# Altium schematic sheet PREAMP1.SchDoc: PREAMP 1
size A3; Date: 2011-11-28; Author: S.Choquette; Revision: 2.0; SheetNumber: 9; SheetTotal: 9
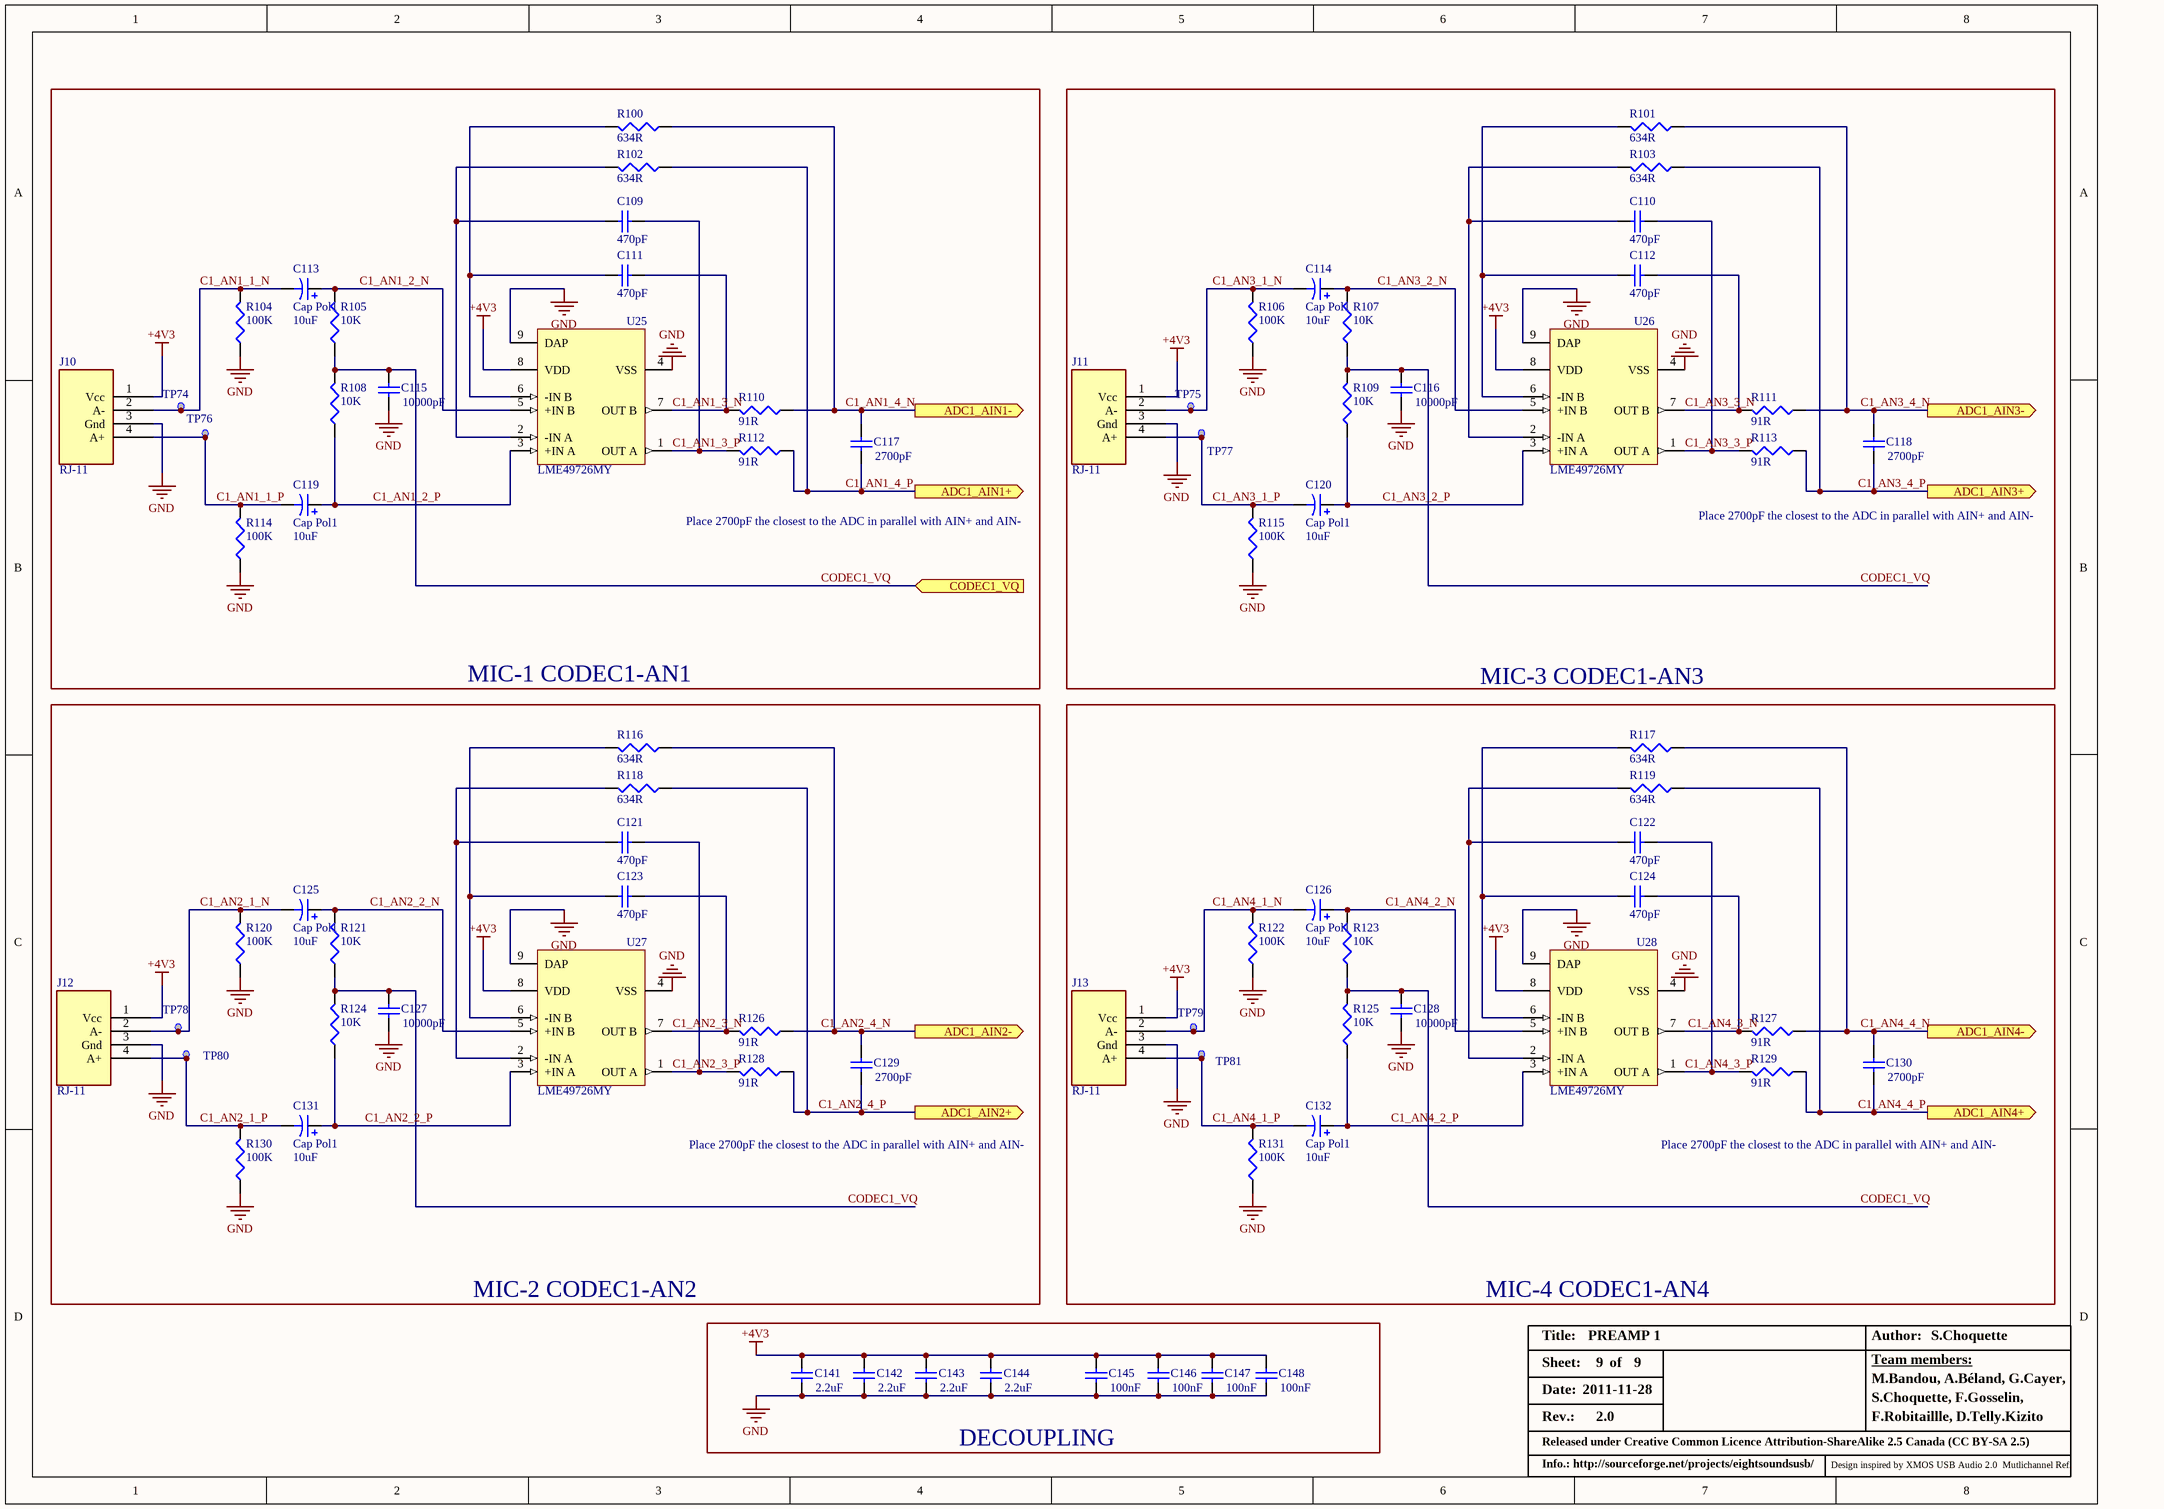
[diagram p0: PREAMP1.SchDoc]

## Parts
C109  value 470pF  [3-0603]
C110  value 470pF  [3-0603]
C111  value 470pF  [3-0603]
C112  value 470pF  [3-0603]
C113  Cap Pol1  value 10uF  [AL_ELEC_SMD_B]
C114  Cap Pol1  value 10uF  [AL_ELEC_SMD_B]
C115  value 10000pF  [2-0402]
C116  value 10000pF  [2-0402]
C117  value 2700pF  [2-0402]
C118  value 2700pF  [2-0402]
C119  Cap Pol1  value 10uF  [AL_ELEC_SMD_B]
C120  Cap Pol1  value 10uF  [AL_ELEC_SMD_B]
C121  value 470pF  [3-0603]
C122  value 470pF  [3-0603]
C123  value 470pF  [3-0603]
C124  value 470pF  [3-0603]
C125  Cap Pol1  value 10uF  [AL_ELEC_SMD_B]
C126  Cap Pol1  value 10uF  [AL_ELEC_SMD_B]
C127  value 10000pF  [2-0402]
C128  value 10000pF  [2-0402]
C129  value 2700pF  [2-0402]
C130  value 2700pF  [2-0402]
C131  Cap Pol1  value 10uF  [AL_ELEC_SMD_B]
C132  Cap Pol1  value 10uF  [AL_ELEC_SMD_B]
C141  value 2.2uF  [8-1206]
C142  value 2.2uF  [8-1206]
C143  value 2.2uF  [8-1206]
C144  value 2.2uF  [8-1206]
C145  value 100nF  [2-0402]
C146  value 100nF  [2-0402]
C147  value 100nF  [2-0402]
C148  value 100nF  [2-0402]
J10  RJ-11  [RJ11]
J11  RJ-11  [RJ11]
J12  RJ-11  [RJ11]
J13  RJ-11  [RJ11]
R100  value 634R  [3-0603]
R101  value 634R  [3-0603]
R102  value 634R  [3-0603]
R103  value 634R  [3-0603]
R104  value 100K  [3-0603]
R105  value 10K  [3-0603]
R106  value 100K  [3-0603]
R107  value 10K  [3-0603]
R108  value 10K  [3-0603]
R109  value 10K  [3-0603]
R110  value 91R  [3-0603]
R111  value 91R  [3-0603]
R112  value 91R  [3-0603]
R113  value 91R  [3-0603]
R114  value 100K  [3-0603]
R115  value 100K  [3-0603]
R116  value 634R  [3-0603]
R117  value 634R  [3-0603]
R118  value 634R  [3-0603]
R119  value 634R  [3-0603]
R120  value 100K  [3-0603]
R121  value 10K  [3-0603]
R122  value 100K  [3-0603]
R123  value 10K  [3-0603]
R124  value 10K  [3-0603]
R125  value 10K  [3-0603]
R126  value 91R  [3-0603]
R127  value 91R  [3-0603]
R128  value 91R  [3-0603]
R129  value 91R  [3-0603]
R130  value 100K  [3-0603]
R131  value 100K  [3-0603]
TP74  TP  [TP]  (value not drawn)
TP75  TP  [TP]  (value not drawn)
TP76  TP  [TP]  (value not drawn)
TP77  TP  [TP]  (value not drawn)
TP78  TP  [TP]  (value not drawn)
TP79  TP  [TP]  (value not drawn)
TP80  TP  [TP]  (value not drawn)
TP81  TP  [TP]  (value not drawn)
U25  LME49726MY  [LME49726]
U26  LME49726MY  [LME49726]
U27  LME49726MY  [LME49726]
U28  LME49726MY  [LME49726]

## Blocks framed on the sheet
MIC-1 CODEC1-AN1: C109 C111 C113 C115 C117 C119 J10 R100 R102 R104 R105 R108 R110 R112 R114 TP74 TP76 U25
MIC-3 CODEC1-AN3: C110 C112 C114 C116 C118 C120 J11 R101 R103 R106 R107 R109 R111 R113 R115 TP75 TP77 U26
MIC-2 CODEC1-AN2: C121 C123 C125 C127 C129 C131 J12 R116 R118 R120 R121 R124 R126 R128 R130 TP78 TP80 U27
MIC-4 CODEC1-AN4: C122 C124 C126 C128 C130 C132 J13 R117 R119 R122 R123 R125 R127 R129 R131 TP79 TP81 U28
DECOUPLING: C141-C148

## Ports
ADC1_AIN1+ (out), ADC1_AIN1- (out), ADC1_AIN2+ (out), ADC1_AIN2- (out), ADC1_AIN3+ (out), ADC1_AIN3- (out), ADC1_AIN4+ (out), ADC1_AIN4- (out), CODEC1_VQ (in)

## Nets
+4V3: C141.2 C142.2 C143.2 C144.2 C145.2 C146.2 C147.2 C148.2 J10.1(Vcc) J11.1(Vcc) J12.1(Vcc) J13.1(Vcc) U25.8(VDD) U26.8(VDD) U27.8(VDD) U28.8(VDD)
GND: C115.1 C116.1 C127.1 C128.1 C141.1 C142.1 C143.1 C144.1 C145.1 C146.1 C147.1 C148.1 J10.3(Gnd) J11.3(Gnd) J12.3(Gnd) J13.3(Gnd) R104.1 R106.1 R114.1 R115.1 R120.1 R122.1 R130.1 R131.1 U25.4(VSS) U25.9(DAP) U26.4(VSS) U26.9(DAP) U27.4(VSS) U27.9(DAP) U28.4(VSS) U28.9(DAP)
C1_AN1_1_N: C113.2 J10.2(A-) R104.2 TP74.1
C1_AN1_1_P: C119.2 J10.4(A+) R114.2 TP76.1
C1_AN1_2_N: C113.1 R105.2 U25.5(+IN_B)
C1_AN1_2_P: C119.1 R108.1 U25.3(+IN_A)
C1_AN1_3_N: C111.1 R110.2 U25.7(OUT_B)
C1_AN1_3_P: C109.1 R112.2 U25.1(OUT_A)
C1_AN1_4_N: C117.2 R100.1 R110.1 ; port ADC1_AIN1-
C1_AN1_4_P: C117.1 R102.1 R112.1 ; port ADC1_AIN1+
C1_AN2_1_N: C125.2 J12.2(A-) R120.2 TP78.1
C1_AN2_1_P: C131.2 J12.4(A+) R130.2 TP80.1
C1_AN2_2_N: C125.1 R121.2 U27.5(+IN_B)
C1_AN2_2_P: C131.1 R124.1 U27.3(+IN_A)
C1_AN2_3_N: C123.1 R126.2 U27.7(OUT_B)
C1_AN2_3_P: C121.1 R128.2 U27.1(OUT_A)
C1_AN2_4_N: C129.2 R116.1 R126.1 ; port ADC1_AIN2-
C1_AN2_4_P: C129.1 R118.1 R128.1 ; port ADC1_AIN2+
C1_AN3_1_N: C114.2 J11.2(A-) R106.2 TP75.1
C1_AN3_1_P: C120.2 J11.4(A+) R115.2 TP77.1
C1_AN3_2_N: C114.1 R107.2 U26.5(+IN_B)
C1_AN3_2_P: C120.1 R109.1 U26.3(+IN_A)
C1_AN3_3_N: C112.1 R111.2 U26.7(OUT_B)
C1_AN3_3_P: C110.1 R113.2 U26.1(OUT_A)
C1_AN3_4_N: C118.2 R101.1 R111.1 ; port ADC1_AIN3-
C1_AN3_4_P: C118.1 R103.1 R113.1 ; port ADC1_AIN3+
C1_AN4_1_N: C126.2 J13.2(A-) R122.2 TP79.1
C1_AN4_1_P: C132.2 J13.4(A+) R131.2 TP81.1
C1_AN4_2_N: C126.1 R123.2 U28.5(+IN_B)
C1_AN4_2_P: C132.1 R125.1 U28.3(+IN_A)
C1_AN4_3_N: C124.1 R127.2 U28.7(OUT_B)
C1_AN4_3_P: C122.1 R129.2 U28.1(OUT_A)
C1_AN4_4_N: C130.2 R117.1 R127.1 ; port ADC1_AIN4-
C1_AN4_4_P: C130.1 R119.1 R129.1 ; port ADC1_AIN4+
CODEC1_VQ: C115.2 C116.2 C127.2 C128.2 R105.1 R107.1 R108.2 R109.2 R121.1 R123.1 R124.2 R125.2 ; port CODEC1_VQ
NetC109_2: C109.2 R102.2 U25.2(-IN_A)
NetC110_2: C110.2 R103.2 U26.2(-IN_A)
NetC111_2: C111.2 R100.2 U25.6(-IN_B)
NetC112_2: C112.2 R101.2 U26.6(-IN_B)
NetC121_2: C121.2 R118.2 U27.2(-IN_A)
NetC122_2: C122.2 R119.2 U28.2(-IN_A)
NetC123_2: C123.2 R116.2 U27.6(-IN_B)
NetC124_2: C124.2 R117.2 U28.6(-IN_B)

## Notes on the sheet
- Place 2700pF the closest to the ADC in parallel with AIN+ and AIN-
- Title:
- Date:
- Sheet:
- of
- Author:
- Team members:
- M.Bandou, A.Béland, G.Cayer,
- Rev.:
- Released under Creative Common Licence Attribution-ShareAlike 2.5 Canada (CC BY-SA 2.5)
- S.Choquette, F.Gosselin,
- F.Robitaillle, D.Telly.Kizito
- Info.: http://sourceforge.net/projects/eightsoundsusb/
- Design inspired by XMOS USB Audio 2.0  Mutlichannel Ref.

## Library data of the parts
C109-C112 C121-C124 = Cap: MLCC 470pF 0603 COG 50V; Manufacturer: Murata; Part Number: GRM1885C1H471JA01D; Cost: 0,005
C113 C114 C119 C120 C125 C126 C131 C132 = Cap Pol1: Al Elec 10uF CaseB 16V; Manufacturer: Panasonic; Part Number: EEEFK1C100R; Cost: *
C115 C116 C127 C128 = Cap: MLCC 10000pF 0402 X7R 25V; Manufacturer: Murata; Part Number: GRM155R71E103KA01D; Cost: 0,005
C117 C118 C129 C130 = Cap: Temperature Compensating 2700pF 0402 COG 10V; Manufacturer: Murata; Part Number: GRM1557U1A272JA01D; Cost: 0,005
C141-C144 = Cap: MLCC 2.2uF 1206 X7R 50V; Manufacturer: Murata; Part Number: GRM31CR71H225KA88L
C145-C148 = Cap: MLCC 100nF 0402 X7R 16V; Manufacturer: Murata; Part Number: GRM155R71C104KA88; Cost: 0,005
J10 J12 = RJ-11: CONN 6-4 MOD JACK; Part Number: SS-6446-NF; Manufacturer: Stewart Connector
J11 J13 = RJ-11: CONN 6-4 MOD JACK; Manufacturer: Stewart Connector; Part Number: SS-6446-NF
R100-R103 R116-R119 = Res3: RES 634R 0603 1%; Manufacturer: ROHM; Part Number: MCR03EZPFX6340; Cost: *
R104 R106 R114 R115 R120 R122 R130 R131 = Res3: RES 100k 0603 1%; Manufacturer: ROHM; Part Number: MCR03EZPFX1003; Cost: *
R105 R107-R109 R121 R123-R125 = Res3: RES 10k 0603 1%; Manufacturer: ROHM; Part Number: MCR03EZPFX1002; Cost: *
R110-R113 R126-R129 = Res3: RES 634R 0603 1%; Manufacturer: ROHM; Part Number: MCR03EZPFX91R0; Cost: *
U25-U27 = LME49726MY: High Current, Low Distortion Rail-to-Rail Output Audio Operational Amplifier; Manufacturer: National Semiconductor; CompType: Audio IC; PackageTopMarking: ZXTT*ZA3; PowerWise: N; Published: 4-Dec-2008; DatasheetVersion: Nov-2008; PackageVersion: revA, Nov-2003; PackageReference: MUY08A; Publisher: Altium Limited; PackageDescription: Molded Mini-SO, Exposed Pad, .118 x .118 x .034in Body, 8 Lead, .0256in Pitch; Part Number: LME49726MY; RoHS: Y; PinCount: 8; Code_JEDEC: MO-187-AA; ComponentLink1Description: LME49726 Datasheet; ComponentLink1URL: http://www.national.com/ds/LM/LME49726.pdf; ComponentLink2Description: LME49726 Web Page; ComponentLink2URL: http://www.national.com/pf/LM/LME49726.html; ComponentLink3Description: MUY08A Package Page; ComponentLink3URL: http://www.national.com/packaging/folders/muy08a.html
U28 = LME49726MY: High Current, Low Distortion Rail-to-Rail Output Audio Operational Amplifier; Manufacturer: National Semiconductor; PackageTopMarking: ZXTT*ZA3; PowerWise: N; PackageDescription: Molded Mini-SO, Exposed Pad, .118 x .118 x .034in Body, 8 Lead, .0256in Pitch; Part Number: LME49726MY; RoHS: Y; PinCount: 8; Code_JEDEC: MO-187-AA